# EAGLE design zamekKodowy_nadajnik (EAGLE 6.3)
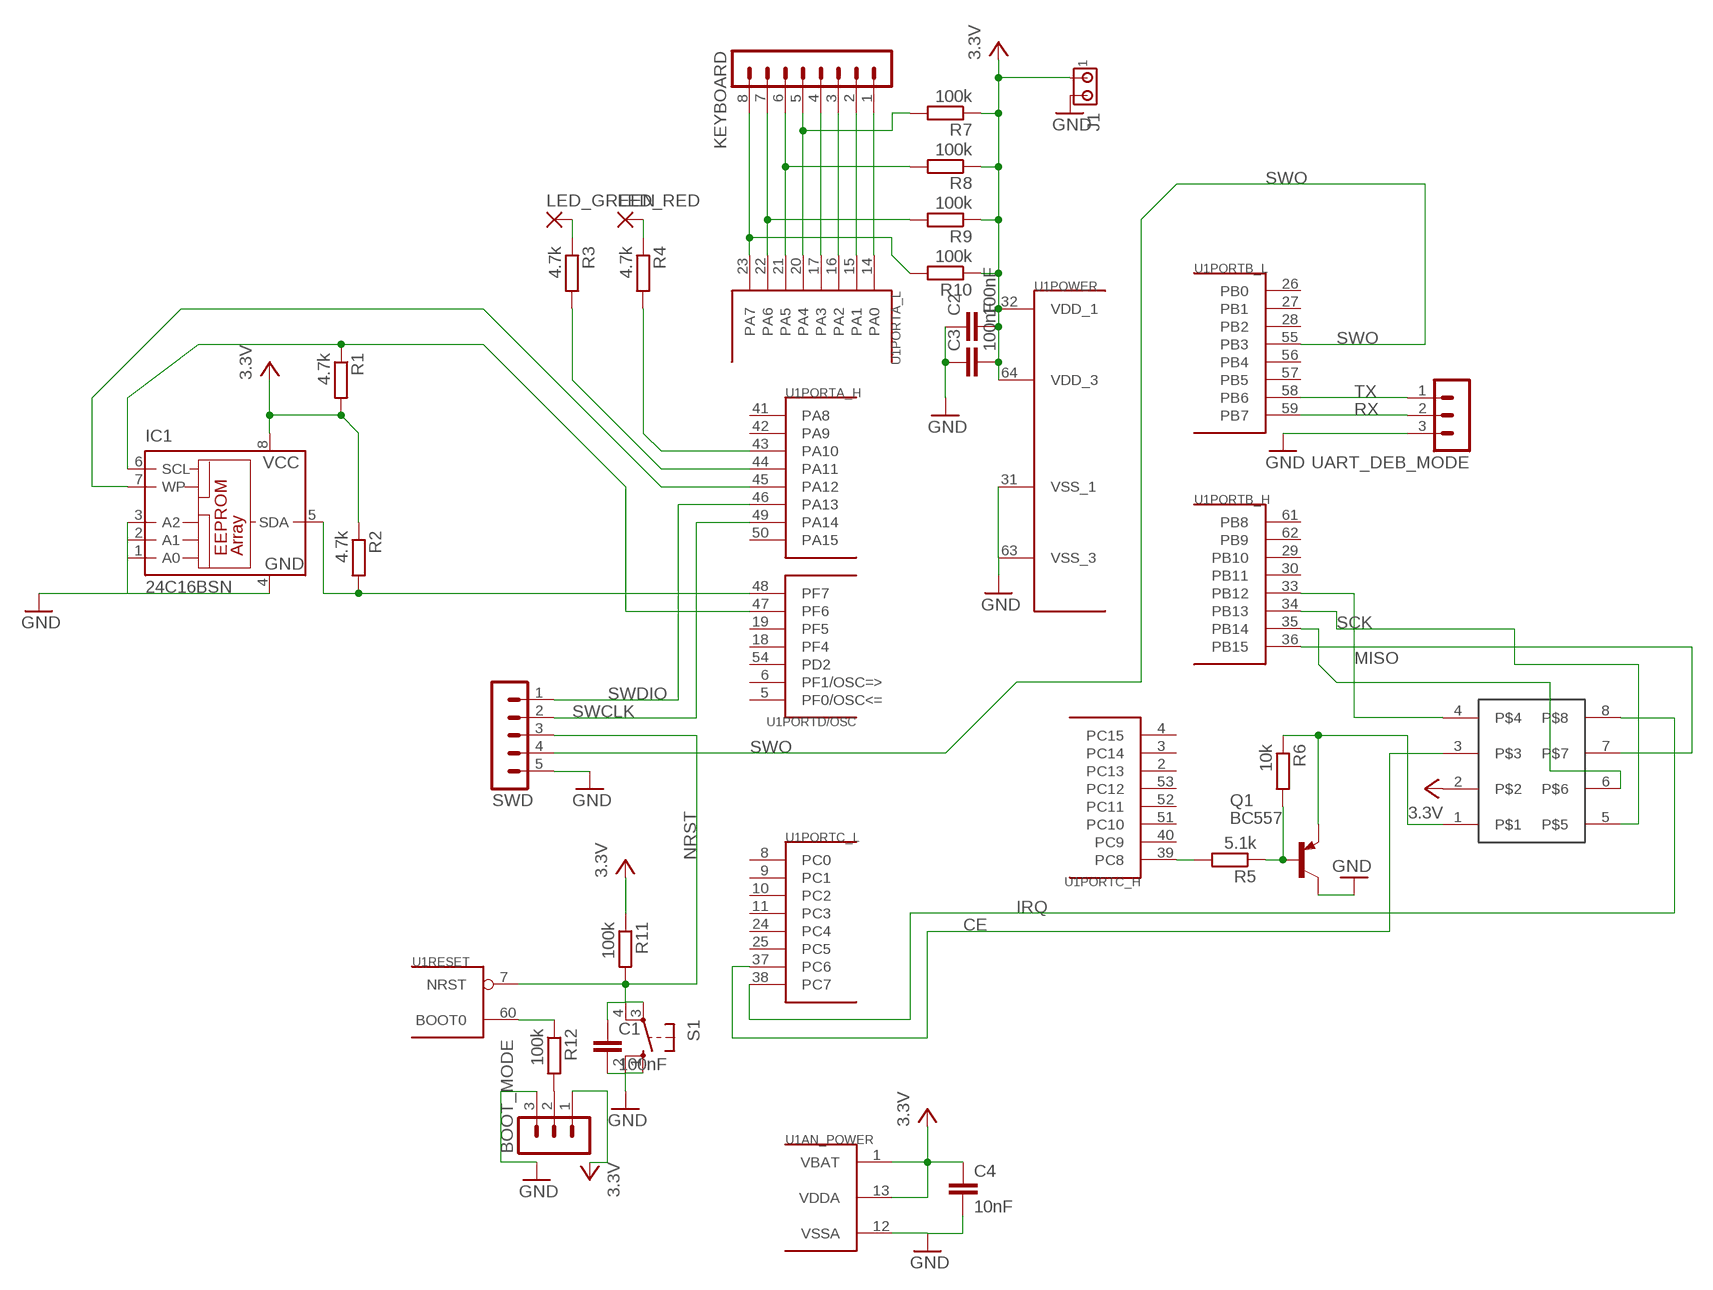
[diagram p0: schematic, sheet 1]

## Parts
BOOT_MODE  MA03-1  [MA03-1]
C1  100nF  C-EUC0603  [C0603]
C2  100nF  C-EUC0603  [C0603]
C3  100nF  C-EUC0603  [C0603]
C4  10nF  C-EUC0603  [C0603]
CON1  CON10  [CON10]
IC1  24C16BSN  [SO-08]
J1  MTA02-100  [10X02MTA]
KEYBOARD  MA08-1  [MA08-1]
LED_GREEN  2,54/0,9  [2,54/0,9]
LED_RED  2,54/0,9  [2,54/0,9]
Q1  BC557  [TO92]
R1  4.7k  R-EU_R0603  [R0603]
R2  4.7k  R-EU_R0603  [R0603]
R3  4.7k  R-EU_R0603  [R0603]
R4  4.7k  R-EU_R0603  [R0603]
R5  5.1k  R-EU_R0603  [R0603]
R6  10k  R-EU_R0603  [R0603]
R7  100k  R-EU_R0603  [R0603]
R8  100k  R-EU_R0603  [R0603]
R9  100k  R-EU_R0603  [R0603]
R10  100k  R-EU_R0603  [R0603]
R11  100k  R-EU_R0603  [R0603]
R12  100k  R-EU_R0603  [R0603]
S1  10-XX  [B3F-10XX]
SWD  MA05-1  [MA05-1]
U1  STM32F10XRXT6  [TQFP64]
UART_DEB_MODE  MA03-1  [MA03-1]

## Nets
CE: CON1.3 U1.37(PORTC_L:PC6)
GND: BOOT_MODE.3 C1.2 C2.1 C3.1 C4.2 IC1.1(A0) IC1.2(A1) IC1.3(A2) IC1.4(GND) J1.2 Q1.3(C) S1.1(S) S1.2(S1) SWD.5 U1.12(AN_POWER:VSSA) U1.31(POWER:VSS_1) U1.63(POWER:VSS_3) UART_DEB_MODE.3
IRQ: CON1.8 U1.38(PORTC_L:PC7)
MISO: CON1.7 U1.36(PORTB_H:PB15)
MOSI: CON1.6 U1.35(PORTB_H:PB14)
N$1: IC1.5(SDA) R2.2 U1.48(PORTD/OSC:PF7)
N$2: IC1.6(SCL) R1.1 U1.47(PORTD/OSC:PF6)
N$3: IC1.7(WP) U1.45(PORTA_H:PA12)
N$4: R3.2 U1.44(PORTA_H:PA11)
N$5: R4.2 U1.43(PORTA_H:PA10)
N$6: LED_GREEN.1(P) R3.1
N$7: LED_RED.1(P) R4.1
N$8: Q1.2(B) R5.1 R6.2
N$9: KEYBOARD.8 R10.2 U1.23(PORTA_L:PA7)
N$10: R5.2 U1.39(PORTC_H:PC8)
N$11: CON1.1 Q1.1(E) R6.1
N$12: KEYBOARD.7 R9.2 U1.22(PORTA_L:PA6)
N$13: KEYBOARD.6 R8.2 U1.21(PORTA_L:PA5)
N$14: KEYBOARD.5 R7.2 U1.20(PORTA_L:PA4)
N$15: KEYBOARD.4 U1.17(PORTA_L:PA3)
N$16: KEYBOARD.3 U1.16(PORTA_L:PA2)
N$17: KEYBOARD.2 U1.15(PORTA_L:PA1)
N$18: KEYBOARD.1 U1.14(PORTA_L:PA0)
N$19: R12.1 U1.60(RESET:BOOT0)
N$20: BOOT_MODE.2 R12.2
NRST: C1.1 R11.2 S1.3(P) S1.4(P1) SWD.3 U1.7(RESET:NRST)
NSS: CON1.4 U1.33(PORTB_H:PB12)
RX: U1.59(PORTB_L:PB7) UART_DEB_MODE.2
SCK: CON1.5 U1.34(PORTB_H:PB13)
SWCLK: SWD.2 U1.49(PORTA_H:PA14)
SWDIO: SWD.1 U1.46(PORTA_H:PA13)
SWO: SWD.4 U1.55(PORTB_L:PB3)
TX: U1.58(PORTB_L:PB6) UART_DEB_MODE.1
VCC: BOOT_MODE.1 C2.2 C3.2 C4.1 CON1.2 IC1.8(VCC) J1.1 R1.2 R2.1 R7.1 R8.1 R9.1 R10.1 R11.1 U1.1(AN_POWER:VBAT) U1.13(AN_POWER:VDDA) U1.32(POWER:VDD_1) U1.64(POWER:VDD_3) ; supply symbol labelled 3.3V
Unconnected: U1.2(PORTC_H:PC13) U1.3(PORTC_H:PC14) U1.4(PORTC_H:PC15) U1.5(PORTD/OSC:PF0/OSC<=) U1.6(PORTD/OSC:PF1/OSC=>) U1.8(PORTC_L:PC0) U1.9(PORTC_L:PC1) U1.10(PORTC_L:PC2) U1.11(PORTC_L:PC3) U1.18(PORTD/OSC:PF4) U1.19(PORTD/OSC:PF5) U1.24(PORTC_L:PC4) U1.25(PORTC_L:PC5) U1.26(PORTB_L:PB0) U1.27(PORTB_L:PB1) U1.28(PORTB_L:PB2) U1.29(PORTB_H:PB10) U1.30(PORTB_H:PB11) U1.40(PORTC_H:PC9) U1.41(PORTA_H:PA8) U1.42(PORTA_H:PA9) U1.50(PORTA_H:PA15) U1.51(PORTC_H:PC10) U1.52(PORTC_H:PC11) U1.53(PORTC_H:PC12) U1.54(PORTD/OSC:PD2) U1.56(PORTB_L:PB4) U1.57(PORTB_L:PB5) U1.61(PORTB_H:PB8) U1.62(PORTB_H:PB9)

## Library data of the parts
BOOT_MODE UART_DEB_MODE = con-lstb:MA03-1: PIN HEADER; OC_FARNELL: unknown; OC_NEWARK: unknown
C1-C4 = resistor:C-EU: CAPACITOR, European symbol
CON1 = con-harting:CON10: CONNECTOR; OC_FARNELL: unknown; OC_NEWARK: unknown
IC1 = microchip:24*: Serial EEPROM I2C; MPN: AT24C16BN-SH-B; OC_FARNELL: 1362651; OC_NEWARK: 50M3324
J1 = con-amp:MTA02-100: AMP connector
KEYBOARD = con-lstb:MA08-1: PIN HEADER; OC_FARNELL: unknown; OC_NEWARK: unknown
LED_GREEN LED_RED = wirepad:2,54/0,9: THROUGH-HOLE PAD
Q1 = transistor-pnp:BC557: PNP Transistor
R1-R12 = rcl:R-EU_: RESISTOR, European symbol
S1 = switch-omron:10-XX: OMRON SWITCH; MPN: B3F-1000; OC_FARNELL: 176432; OC_NEWARK: 36M3542
SWD = con-lstb:MA05-1: PIN HEADER; OC_FARNELL: unknown; OC_NEWARK: unknown
U1 = stm32F051R8:STM32F10XRXT6: STM32F101/103 64pin LQFP

## Net classes
0 default: clearance 0.152 mm

## Board
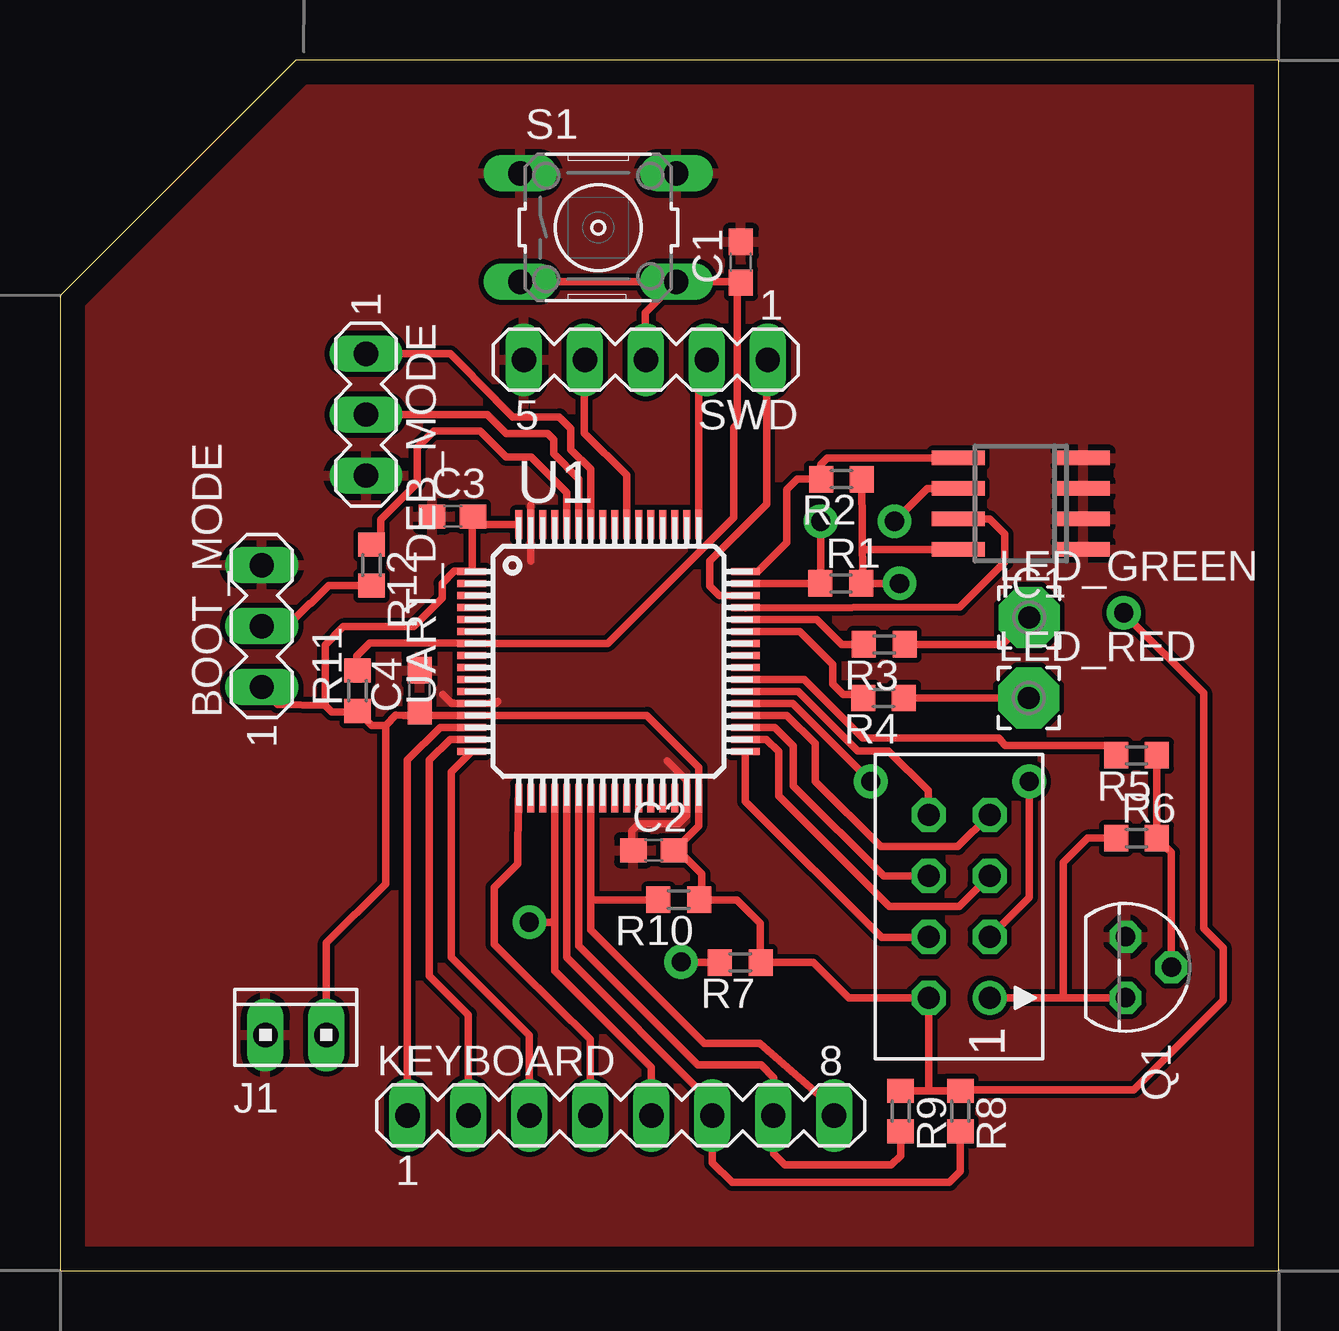
[diagram p1: board, top side]
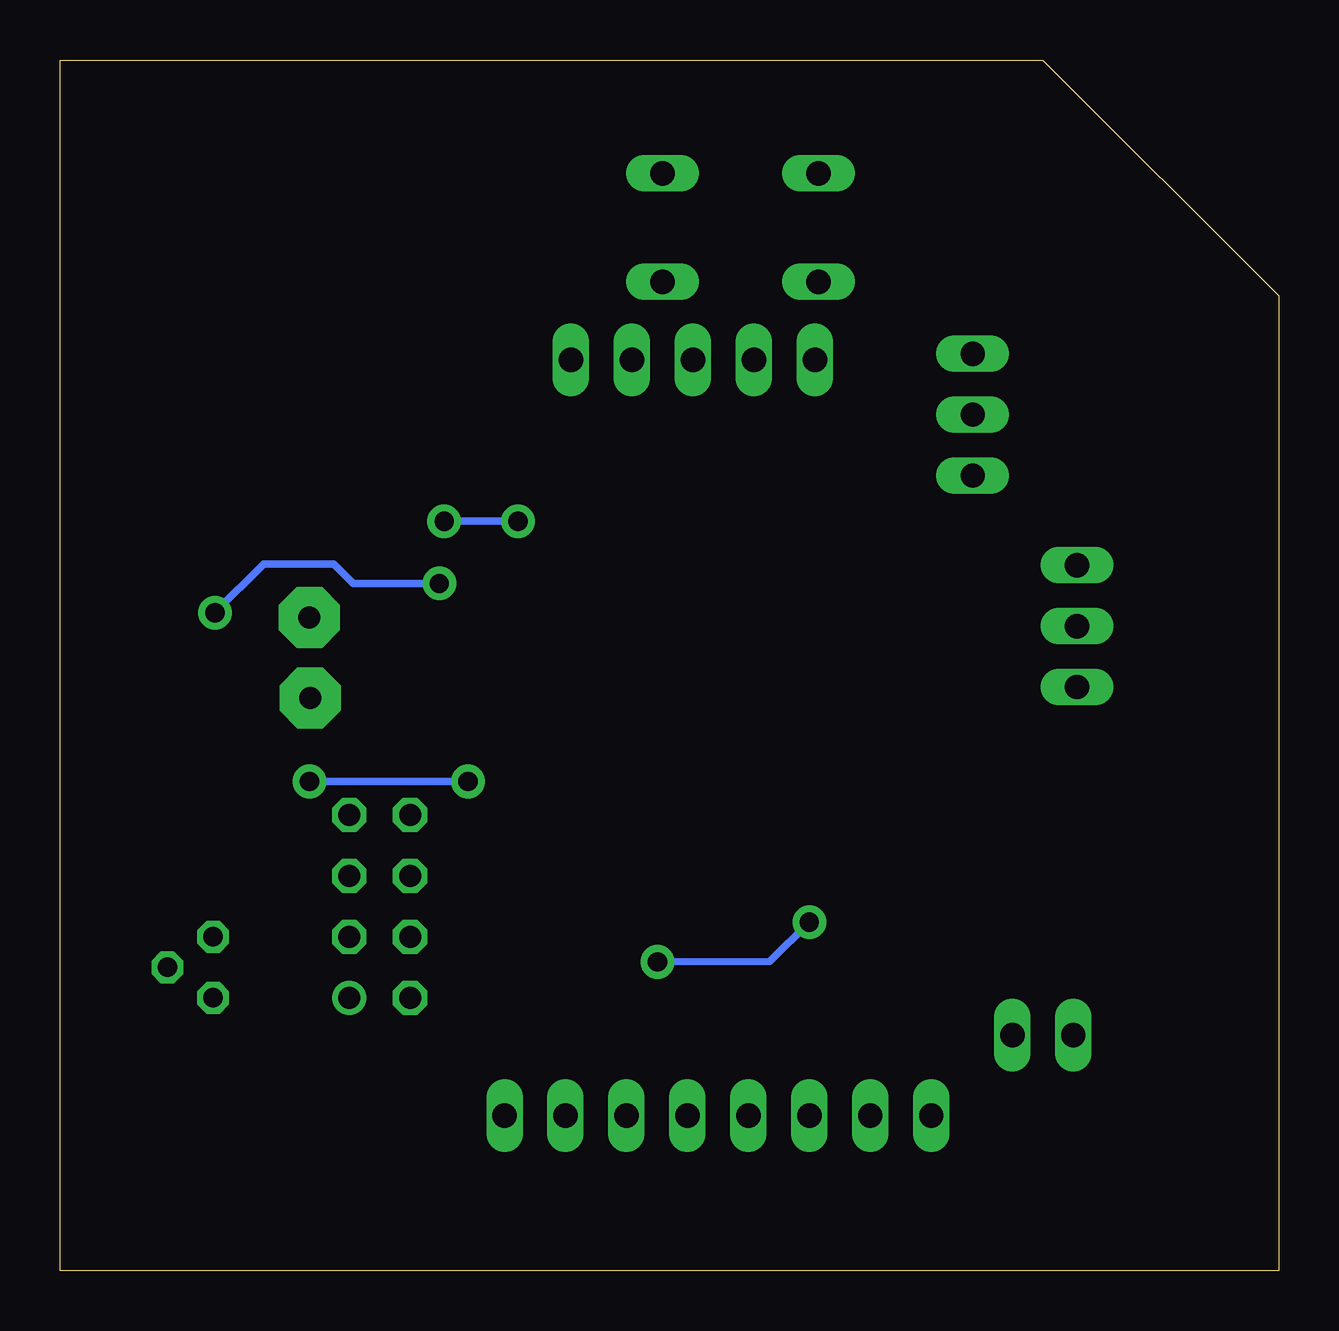
[diagram p2: board, bottom side, seen from below]

Size 50.78 x 50.47 mm. Coordinates in mm from the lower left corner, seen from the top.
Outline: 0,0 50.78,0 50.78,50.47 9.83,50.47 0,40.64 0,0
Copper layers (1*16): Top 0.035mm / dielectric 1.5mm / Bottom 0.035mm
Design rules "default": minimum track width 10mil, minimum drill 24mil, track to track 8mil, track to pad 8mil, pad to pad 8mil, via to via 8mil, smd to smd 8mil, copper to edge 40mil, drill to drill 8mil, minimum pad ring 10mil, minimum via ring 8mil, stop-mask expansion 4mil, vias tented up to drill 0mil, thermal gap 10mil

### Footprints (pad centres in the part's own frame; a part is rotated, then mirrored left to right if it is on the bottom)
MA03-1 = drill 1.016 long: 1 -2.54,0; 2 0,0; 3 2.54,0
C0603 = smd 1.1 x 1: 1 -0.85,0; 2 0.85,0
CON10 = drill 0.914: 1 -5.08,-1.27 | drill 0.914 octagon: 2 -5.08,1.27; 3 -2.54,-1.27; 4 -2.54,1.27; 5 0,-1.27; 6 0,1.27; 7 2.54,-1.27; 8 2.54,1.27
SO-08 = smd 0.6 x 2.2: 1 -1.905,-2.6; 2 -0.635,-2.6; 3 0.635,-2.6; 4 1.905,-2.6; 5 1.905,2.6; 6 0.635,2.6; 7 -0.635,2.6; 8 -1.905,2.6
10X02MTA = drill 1.016 long: 1 1.27,0; 2 -1.27,0
MA08-1 = drill 1.016 long: 1 -8.89,0; 2 -6.35,0; 3 -3.81,0; 4 -1.27,0; 5 1.27,0; 6 3.81,0; 7 6.35,0; 8 8.89,0
2,54/0,9 = drill 0.914 pad 2.54 octagon: 1 0,0
TO92 = drill 0.813 octagon: 1 1.27,0; 2 0,1.905; 3 -1.27,0
R0603 = smd 1 x 1.1: 1 -0.85,0; 2 0.85,0
B3F-10XX = drill 1.016 long: 1 -3.251,2.261; 2 3.251,2.261; 3 -3.251,-2.261; 4 3.251,-2.261
MA05-1 = drill 1.016 long: 1 -5.08,0; 2 -2.54,0; 3 0,0; 4 2.54,0; 5 5.08,0
TQFP64 = smd 1.2 x 0.3: 1 -5.7,3.75; 2 -5.7,3.25; 3 -5.7,2.75; 4 -5.7,2.25; 5 -5.7,1.75; 6 -5.7,1.25; 7 -5.7,0.75; 8 -5.7,0.25; 9 -5.7,-0.25; 10 -5.7,-0.75; 11 -5.7,-1.25; 12 -5.7,-1.75; 13 -5.7,-2.25; 14 -5.7,-2.75; 15 -5.7,-3.25; 16 -5.7,-3.75; 33 5.7,-3.75; 34 5.7,-3.25; 35 5.7,-2.75; 36 5.7,-2.25; 37 5.7,-1.75; 38 5.7,-1.25; 39 5.7,-0.75; 40 5.7,-0.25; 41 5.7,0.25; 42 5.7,0.75; 43 5.7,1.25; 44 5.7,1.75; 45 5.7,2.25; 46 5.7,2.75; 47 5.7,3.25; 48 5.7,3.75 | smd 0.3 x 1.2: 17 -3.75,-5.7; 18 -3.25,-5.7; 19 -2.75,-5.7; 20 -2.25,-5.7; 21 -1.75,-5.7; 22 -1.25,-5.7; 23 -0.75,-5.7; 24 -0.25,-5.7; 25 0.25,-5.7; 26 0.75,-5.7; 27 1.25,-5.7; 28 1.75,-5.7; 29 2.25,-5.7; 30 2.75,-5.7; 31 3.25,-5.7; 32 3.75,-5.7; 49 3.75,5.7; 50 3.25,5.7; 51 2.75,5.7; 52 2.25,5.7; 53 1.75,5.7; 54 1.25,5.7; 55 0.75,5.7; 56 0.25,5.7; 57 -0.25,5.7; 58 -0.75,5.7; 59 -1.25,5.7; 60 -1.75,5.7; 61 -2.25,5.7; 62 -2.75,5.7; 63 -3.25,5.7; 64 -3.75,5.7

### Placement (x,y rotation side)
BOOT_MODE  8.41,26.87 90 top
C1  28.37,42.04 90 top
C2  24.74,17.53 0 top
C3  16.36,31.45 0 top
C4  14.99,24.18 90 top
CON1  37.47,16.46 90 top
IC1  40.03,31.98 90 top
J1  9.83,9.83 0 top
KEYBOARD  23.37,6.48 0 top
LED_GREEN  40.39,27.23 0 top
LED_RED  40.36,23.88 0 top
Q1  44.4,12.65 270 top
R1  32.54,28.65 0 top
R2  32.56,32.99 180 top
R3  34.34,26.11 180 top
R4  34.32,23.88 180 top
R5  44.86,21.49 180 top
R6  44.86,18.03 0 top
R7  28.35,12.85 180 top
R8  37.52,6.65 270 top
R9  35.03,6.65 270 top
R10  25.78,15.47 180 top
R11  12.4,24.18 90 top
R12  12.98,29.41 270 top
S1  22.43,43.48 0 top
SWD  24.41,37.97 180 top
U1  22.86,25.4 0 top
UART_DEB_MODE  12.75,35.69 270 top

### Tracks (layer width: path | path; a pad name or v marks a point on that pad's centre or on a via)
CE  (via drill 0.8 pad 1.4)
  Top 0.305: U1.37 30.53,23.65 v33.78,20.4 | v40.39,20.4 40.39,15.57 CON1.3
  Bottom 0.305: v33.78,20.4 v40.39,20.4
GND
  Top 0.305: U1.63 19.61,31.93 19.61,29.59 | 15.95,24.03 16.33,23.65 U1.12 18.16,23.65 18.24,23.72 | U1.31 26.11,18.97 | 26.11,18.97 25.76,18.62 24.11,18.62 23.82,18.34 23.82,17.59 C2.1 | 26.11,18.97 26.11,20.45 25.3,21.26
  pour Top: 0,0 49.53,0 50.8,1.27 50.8,49.53 49.53,50.8 10.16,50.8 0,40.64
IRQ
  Top 0.305: U1.38 30.77,24.15 33.25,21.67 34.52,21.67 36.17,20.02 36.17,19.02 CON1.8
MISO
  Top 0.305: U1.36 30.29,23.15 31.47,21.97 31.47,20.4 34.19,17.68 37.41,17.68 CON1.7
MOSI
  Top 0.305: U1.35 29.78,22.65 30.56,21.87 30.56,20.22 34.31,16.46 CON1.6
N$1
  Top 0.305: IC1.5 31.98,33.88 31.7,33.6 31.7,33.01 R2.2 30.71,32.99 30.28,32.56 30.28,30.35 29.07,29.15 U1.48
N$2  (via drill 0.8 pad 1.4)
  Top 0.305: U1.47 R1.1 31.7,28.66 v31.7,31.24 | IC1.6 36.14,32.61 v34.77,31.24
  Bottom 0.305: v34.77,31.24 v31.7,31.24
N$3
  Top 0.305: IC1.7 38.73,31.34 39.37,30.71 39.37,29.54 37.49,27.66 28.57,27.64 U1.45
N$4
  Top 0.305: U1.44 31.52,27.15 32.56,26.11 R3.2
N$5
  Top 0.305: U1.43 30.83,26.65 32.21,25.27 32.21,24.46 32.64,24.03 33.31,24.03 R4.2
N$6
  Top 0.305: R3.1 39.27,26.11 LED_GREEN.1
N$7
  Top 0.305: R4.1 LED_RED.1
N$8
  Top 0.305: Q1.2 46.3,17.44 R6.2 R5.1
N$9
  Top 0.305: KEYBOARD.8 32.26,6.78 29.16,9.47 26.85,9.47 22.11,14.21 22.11,15.47 | U1.23 22.11,15.47 | R10.2 22.11,15.47
N$10
  Top 0.305: U1.39 31,24.65 33.45,22.2 39.12,22.2 39.19,22.12 39.19,22.1 39.4,21.89 43.6,21.89 R5.2
N$11
  Top 0.305: Q1.1 41.88,11.38 | 41.88,11.38 CON1.1 | R6.1 42.82,18.03 41.81,17.02 41.81,11.46 41.88,11.38
N$12
  Top 0.305: U1.22 21.61,13.54 26.57,8.59 29.21,8.59 29.74,8.05 29.74,6.5 | 29.74,6.5 KEYBOARD.7 | 29.74,6.5 29.74,4.88 30.2,4.42 34.65,4.42 35.03,4.8 R9.2
N$13
  Top 0.305: KEYBOARD.6 27.18,6.96 | U1.21 21.11,19.68 21.11,13.06 27.18,6.99 KEYBOARD.6 | KEYBOARD.6 27.18,4.5 28.02,3.68 37.06,3.68 37.52,4.14 R8.2
N$14  (via drill 0.8 pad 1.4)
  Top 0.305: U1.20 20.61,14.66 | 20.61,14.66 20.61,12.51 24.64,8.48 KEYBOARD.5 | R7.2 26.16,12.85 v25.88,12.88 | v19.56,14.53 20.48,14.53 20.61,14.66
  Bottom 0.305: v25.88,12.88 21.21,12.9 v19.56,14.53
N$15
  Top 0.305: KEYBOARD.4 22.1,9.65 19.13,12.57 arc-1 18.09,13.61 18.09,15.98 19.07,16.97 19.1,19.66 U1.17
N$16
  Top 0.305: KEYBOARD.3 19.56,9.8 16.31,13.06 16.31,20.8 U1.16
N$17
  Top 0.305: KEYBOARD.2 17.02,10.67 15.39,12.29 15.39,21.29 16.26,22.15 U1.15
N$18
  Top 0.305: KEYBOARD.1 14.48,21.29 15.85,22.66 U1.14
N$19
  Top 0.305: U1.60 21.11,32.43 19.63,33.91 18.59,33.91 17.5,35 15.57,35 14.88,34.31 14.88,32.84 13.36,31.32 13.36,30.64 R12.1
N$20
  Top 0.305: R12.2 11.19,28.56 10.44,27.81 10.41,27.81 9.5,26.9 8.43,26.9 BOOT_MODE.2
NRST
  Top 0.305: SWD.3 24.38,39.93 S1.4 | S1.3 S1.4 | S1.4 28.34,41.22 C1.1 28.22,41.03 28.22,35.31 28.07,35.15 28.07,31.39 22.82,26.15 U1.7 17.15,26.16 12.9,26.16 12.37,25.63 12.37,25.06 R11.2
NSS
  Top 0.305: U1.33 28.56,19.57 34.24,13.89 36.17,13.89 CON1.4
RX
  Top 0.305: U1.59 21.61,31.12 21.61,32.99 20.57,34.06 20.57,34.65 20.32,34.9 18.59,34.9 17.8,35.69 UART_DEB_MODE.2
SCK
  Top 0.305: U1.34 29.44,22.15 29.95,21.64 29.95,19.79 34.54,15.19 37.47,15.19 CON1.5
SWCLK
  Top 0.305: U1.49 26.61,36.59 SWD.2
SWDIO
  Top 0.305: U1.46 27.48,28.15 27.08,28.55 27.08,29.59 29.44,31.95 29.44,36.88 SWD.1
SWO
  Top 0.305: U1.55 23.61,33.16 21.84,34.92 SWD.4
TX
  Top 0.305: U1.58 22.11,33.41 21.29,34.24 21.29,35.1 20.8,35.59 18.87,35.59 18.16,36.3 18.16,36.32 16.26,38.23 UART_DEB_MODE.1
VCC  (via drill 0.8 pad 1.4)
  Top 0.305: U1.1 | U1.1 16.43,29.16 15.93,28.65 15.93,28.04 14.73,26.85 11.81,26.85 11.05,26.09 11.05,23.57 | 15.21,23.15 U1.13 24.45,23.15 26.62,20.98 U1.32 | 15.21,23.15 14.33,23.15 13.99,23.16 13.56,22.73 | IC1.8 33.48,30.07 33.43,30.12 33.43,30.85 R2.1 33.44,28.7 R1.2 v34.98,28.65 | U1.32 | 36.14,7.5 R8.1 37.55,7.54 44.73,7.54 48.46,11.28 48.46,13.46 47.65,14.28 47.65,24.08 44.32,27.41 v44.32,27.43 | 36.14,7.5 R9.1 | 36.14,7.5 36.2,7.56 CON1.2 32.87,11.38 31.39,12.85 R7.1 29.18,12.86 29.18,14.48 28.19,15.47 R10.1 26.75,15.58 26.75,16.54 25.76,17.53 C2.2 26.61,18.55 U1.32 | J1.1 11.1,13.66 13.56,16.13 13.56,22.73 | C4.1 15.03,23.33 15.21,23.15 | 13.56,22.73 12.99,22.73 R11.1 12.36,23.29 11.33,23.29 11.05,23.57 | 11.05,23.57 9.07,23.6 BOOT_MODE.1 | U1.1 17.17,31.2 C3.2 17.27,31.1 U1.64
  Bottom 0.305: v34.98,28.65 38.56,28.65 39.37,29.46 42.29,29.46 v44.32,27.43

### Text on the board
tDocu: Zamek Kodowy / Nadajnik / Rev. 1.0 / 01/2014